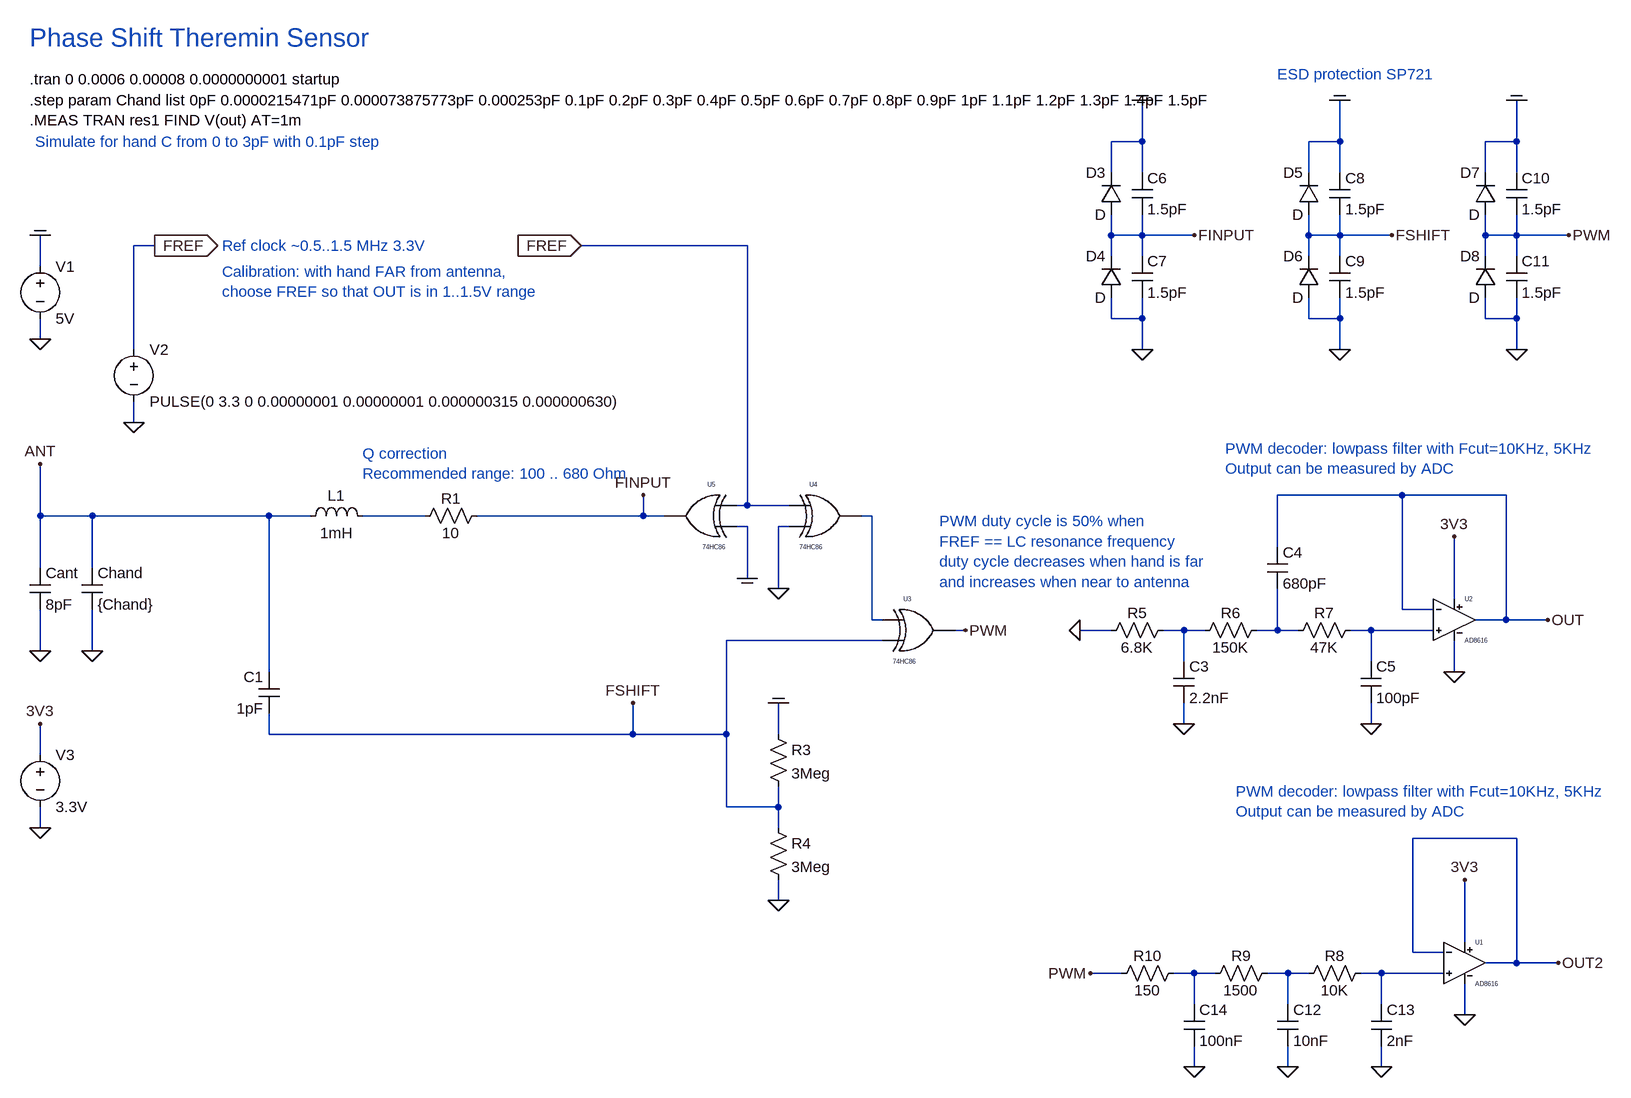
[diagram p0: schematic phase_shift_pwm_v6.asc]
phase_shift_pwm_v6.asc, the LTspice schematic file:
Version 4
SHEET 1 3724 1652
WIRE 1744 -208 1744 -272
WIRE 1744 -208 1696 -208
WIRE 2048 -208 2048 -272
WIRE 2048 -208 2000 -208
WIRE 2320 -208 2320 -272
WIRE 2320 -208 2272 -208
WIRE 1696 -160 1696 -208
WIRE 1744 -160 1744 -208
WIRE 2000 -160 2000 -208
WIRE 2048 -160 2048 -208
WIRE 2272 -160 2272 -208
WIRE 2320 -160 2320 -208
WIRE 1696 -64 1696 -96
WIRE 1744 -64 1744 -96
WIRE 1744 -64 1696 -64
WIRE 1824 -64 1744 -64
WIRE 2000 -64 2000 -96
WIRE 2048 -64 2048 -96
WIRE 2048 -64 2000 -64
WIRE 2128 -64 2048 -64
WIRE 2272 -64 2272 -96
WIRE 2320 -64 2320 -96
WIRE 2320 -64 2272 -64
WIRE 2400 -64 2320 -64
WIRE 224 -48 192 -48
WIRE 1136 -48 880 -48
WIRE 1696 -32 1696 -64
WIRE 1744 -32 1744 -64
WIRE 2000 -32 2000 -64
WIRE 2048 -32 2048 -64
WIRE 2272 -32 2272 -64
WIRE 2320 -32 2320 -64
WIRE 48 -16 48 -64
WIRE 1696 64 1696 32
WIRE 1744 64 1744 32
WIRE 1744 64 1696 64
WIRE 2000 64 2000 32
WIRE 2048 64 2048 32
WIRE 2048 64 2000 64
WIRE 2272 64 2272 32
WIRE 2320 64 2320 32
WIRE 2320 64 2272 64
WIRE 48 96 48 64
WIRE 192 112 192 -48
WIRE 1744 112 1744 64
WIRE 2048 112 2048 64
WIRE 2320 112 2320 64
WIRE 192 224 192 192
WIRE 2144 336 1952 336
WIRE 2304 336 2144 336
WIRE 1136 352 1136 -48
WIRE 1136 352 1120 352
WIRE 1200 352 1136 352
WIRE 48 368 48 288
WIRE 128 368 48 368
WIRE 400 368 128 368
WIRE 464 368 400 368
WIRE 640 368 544 368
WIRE 976 368 976 336
WIRE 976 368 720 368
WIRE 1008 368 976 368
WIRE 1328 368 1312 368
WIRE 1136 384 1120 384
WIRE 1200 384 1184 384
WIRE 1952 416 1952 336
WIRE 48 448 48 368
WIRE 128 448 128 368
WIRE 1136 464 1136 384
WIRE 1184 480 1184 384
WIRE 2224 496 2224 400
WIRE 2144 512 2144 336
WIRE 2192 512 2144 512
WIRE 1328 528 1328 368
WIRE 1344 528 1328 528
WIRE 2304 528 2304 336
WIRE 2304 528 2256 528
WIRE 2368 528 2304 528
WIRE 1472 544 1456 544
WIRE 1696 544 1648 544
WIRE 1808 544 1776 544
WIRE 1840 544 1808 544
WIRE 1952 544 1952 480
WIRE 1952 544 1920 544
WIRE 1984 544 1952 544
WIRE 2096 544 2064 544
WIRE 2192 544 2096 544
WIRE 1344 560 1104 560
WIRE 48 576 48 512
WIRE 128 576 128 512
WIRE 1808 592 1808 544
WIRE 2096 592 2096 544
WIRE 400 608 400 368
WIRE 2224 608 2224 560
WIRE 1808 688 1808 656
WIRE 2096 688 2096 656
WIRE 400 704 400 672
WIRE 960 704 960 656
WIRE 960 704 400 704
WIRE 1104 704 1104 560
WIRE 1104 704 960 704
WIRE 1184 704 1184 656
WIRE 48 736 48 688
WIRE 1104 816 1104 704
WIRE 1184 816 1184 784
WIRE 1184 816 1104 816
WIRE 48 848 48 816
WIRE 1184 848 1184 816
WIRE 2320 864 2160 864
WIRE 1184 960 1184 928
WIRE 2240 1024 2240 928
WIRE 2160 1040 2160 864
WIRE 2208 1040 2160 1040
WIRE 2320 1056 2320 864
WIRE 2320 1056 2272 1056
WIRE 2384 1056 2320 1056
WIRE 1712 1072 1664 1072
WIRE 1824 1072 1792 1072
WIRE 1856 1072 1824 1072
WIRE 1968 1072 1936 1072
WIRE 2000 1072 1968 1072
WIRE 2112 1072 2080 1072
WIRE 2208 1072 2112 1072
WIRE 1824 1120 1824 1072
WIRE 1968 1120 1968 1072
WIRE 2112 1120 2112 1072
WIRE 2240 1136 2240 1088
WIRE 1824 1216 1824 1184
WIRE 1968 1216 1968 1184
WIRE 2112 1216 2112 1184
FLAG 48 96 0
FLAG 224 -48 FREF
IOPIN 224 -48 Out
FLAG 192 224 0
FLAG 48 288 ANT
FLAG 48 576 0
FLAG 128 576 0
FLAG 1472 544 PWM
FLAG 880 -48 FREF
IOPIN 880 -48 In
FLAG 1184 960 0
FLAG 2224 608 0
FLAG 2368 528 OUT
FLAG 2096 688 0
FLAG 48 -64 COM
FLAG 1184 656 COM
FLAG 1744 112 0
FLAG 1744 -272 COM
FLAG 1824 -64 FINPUT
FLAG 2048 112 0
FLAG 2048 -272 COM
FLAG 2128 -64 FSHIFT
FLAG 2320 112 0
FLAG 2320 -272 COM
FLAG 2400 -64 PWM
FLAG 960 656 FSHIFT
FLAG 976 336 FINPUT
FLAG 1808 688 0
FLAG 1136 464 COM
FLAG 1184 480 0
FLAG 48 848 0
FLAG 48 688 3V3
FLAG 2224 400 3V3
FLAG 2240 1136 0
FLAG 2384 1056 OUT2
FLAG 2112 1216 0
FLAG 1824 1216 0
FLAG 1664 1072 PWM
FLAG 2240 928 3V3
FLAG 1968 1216 0
FLAG 1648 544 0
SYMBOL voltage 48 -32 R0
WINDOW 123 0 0 Left 2
WINDOW 39 0 0 Left 2
SYMATTR InstName V1
SYMATTR Value 5V
SYMBOL voltage 192 96 R0
WINDOW 123 0 0 Left 2
WINDOW 39 0 0 Left 2
SYMATTR InstName V2
SYMATTR Value PULSE(0 3.3 0 0.00000001 0.00000001 0.000000315 0.000000630)
SYMBOL ind 448 384 R270
WINDOW 0 32 56 VTop 2
WINDOW 3 5 56 VBottom 2
SYMATTR InstName L1
SYMATTR Value 1mH
SYMATTR SpiceLine Ipk=0.1 Rser=19.8 Rpar=6.283Meg Cpar=1.24pF
SYMBOL cap 32 448 R0
SYMATTR InstName Cant
SYMATTR Value 8pF
SYMBOL cap 112 448 R0
SYMATTR InstName Chand
SYMATTR Value {Chand}
SYMBOL EXTRA\\74HC\\74hc86 1392 480 R0
SYMATTR InstName U3
SYMBOL res 736 352 R90
WINDOW 0 5 56 VBottom 2
WINDOW 3 27 56 VTop 2
SYMATTR InstName R1
SYMATTR Value 10
SYMBOL cap 416 672 R180
WINDOW 0 24 56 Left 2
WINDOW 3 24 8 Left 2
SYMATTR InstName C1
SYMATTR Value 1pF
SYMBOL res 1168 688 R0
SYMATTR InstName R3
SYMATTR Value 3Meg
SYMBOL res 1168 832 R0
SYMATTR InstName R4
SYMATTR Value 3Meg
SYMBOL res 2080 528 R90
WINDOW 0 5 56 VBottom 2
WINDOW 3 27 56 VTop 2
SYMATTR InstName R7
SYMATTR Value 47K
SYMBOL cap 1936 416 R0
SYMATTR InstName C4
SYMATTR Value 680pF
SYMBOL cap 2080 592 R0
SYMATTR InstName C5
SYMATTR Value 100pF
SYMBOL EXTRA\\AudioOpamp\\AD\\AD8616 2224 528 R0
SYMATTR InstName U2
SYMBOL res 1936 528 R90
WINDOW 0 5 56 VBottom 2
WINDOW 3 27 56 VTop 2
SYMATTR InstName R6
SYMATTR Value 150K
SYMBOL diode 1712 -96 R180
WINDOW 0 24 64 Left 2
WINDOW 3 24 0 Left 2
SYMATTR InstName D3
SYMBOL diode 1712 32 R180
WINDOW 0 24 64 Left 2
WINDOW 3 24 0 Left 2
SYMATTR InstName D4
SYMBOL cap 1728 -160 R0
SYMATTR InstName C6
SYMATTR Value 1.5pF
SYMBOL cap 1728 -32 R0
SYMATTR InstName C7
SYMATTR Value 1.5pF
SYMBOL diode 2016 -96 R180
WINDOW 0 24 64 Left 2
WINDOW 3 24 0 Left 2
SYMATTR InstName D5
SYMBOL diode 2016 32 R180
WINDOW 0 24 64 Left 2
WINDOW 3 24 0 Left 2
SYMATTR InstName D6
SYMBOL cap 2032 -160 R0
SYMATTR InstName C8
SYMATTR Value 1.5pF
SYMBOL cap 2032 -32 R0
SYMATTR InstName C9
SYMATTR Value 1.5pF
SYMBOL diode 2288 -96 R180
WINDOW 0 24 64 Left 2
WINDOW 3 24 0 Left 2
SYMATTR InstName D7
SYMBOL diode 2288 32 R180
WINDOW 0 24 64 Left 2
WINDOW 3 24 0 Left 2
SYMATTR InstName D8
SYMBOL cap 2304 -160 R0
SYMATTR InstName C10
SYMATTR Value 1.5pF
SYMBOL cap 2304 -32 R0
SYMATTR InstName C11
SYMATTR Value 1.5pF
SYMBOL cap 1792 592 R0
SYMATTR InstName C3
SYMATTR Value 2.2nF
SYMBOL res 1792 528 R90
WINDOW 0 5 56 VBottom 2
WINDOW 3 27 56 VTop 2
SYMATTR InstName R5
SYMATTR Value 6.8K
SYMBOL EXTRA\\74HC\\74hc86 1248 304 R0
SYMATTR InstName U4
SYMBOL EXTRA\\74HC\\74hc86 1072 304 M0
SYMATTR InstName U5
SYMBOL voltage 48 720 R0
WINDOW 123 0 0 Left 2
WINDOW 39 0 0 Left 2
SYMATTR InstName V3
SYMATTR Value 3.3V
SYMBOL res 2096 1056 R90
WINDOW 0 5 56 VBottom 2
WINDOW 3 27 56 VTop 2
SYMATTR InstName R8
SYMATTR Value 10K
SYMBOL cap 1952 1120 R0
SYMATTR InstName C12
SYMATTR Value 10nF
SYMBOL cap 2096 1120 R0
SYMATTR InstName C13
SYMATTR Value 2nF
SYMBOL EXTRA\\AudioOpamp\\AD\\AD8616 2240 1056 R0
SYMATTR InstName U1
SYMBOL res 1952 1056 R90
WINDOW 0 5 56 VBottom 2
WINDOW 3 27 56 VTop 2
SYMATTR InstName R9
SYMATTR Value 1500
SYMBOL cap 1808 1120 R0
SYMATTR InstName C14
SYMATTR Value 100nF
SYMBOL res 1808 1056 R90
WINDOW 0 5 56 VBottom 2
WINDOW 3 27 56 VTop 2
SYMATTR InstName R10
SYMATTR Value 150
TEXT 32 -304 Left 2 !.tran 0 0.0006 0.00008 0.0000000001 startup
TEXT 32 -272 Left 2 !.step param Chand list 0pF 0.0000215471pF 0.000073875773pF 0.000253pF 0.1pF 0.2pF 0.3pF 0.4pF 0.5pF 0.6pF 0.7pF 0.8pF 0.9pF 1pF 1.1pF 1.2pF 1.3pF 1.4pF 1.5pF\n.MEAS TRAN res1 FIND V(out) AT=1m
TEXT 328 -48 Left 2 ;Ref clock ~0.5..1.5 MHz 3.3V
TEXT 32 -368 Left 4 ;Phase Shift Theremin Sensor
TEXT 1872 264 Left 2 ;PWM decoder: lowpass filter with Fcut=10KHz, 5KHz\nOutput can be measured by ADC
TEXT 544 272 Left 2 ;Q correction\nRecommended range: 100 .. 680 Ohm
TEXT 1952 -312 Left 2 ;ESD protection SP721
TEXT 328 -8 Left 2 ;Calibration: with hand FAR from antenna,\nchoose FREF so that OUT is in 1..1.5V range
TEXT 1432 376 Left 2 ;PWM duty cycle is 50% when \nFREF == LC resonance frequency\nduty cycle decreases when hand is far \nand increases when near to antenna
TEXT 40 -208 Left 2 ;Simulate for hand C from 0 to 3pF with 0.1pF step
TEXT 1888 792 Left 2 ;PWM decoder: lowpass filter with Fcut=10KHz, 5KHz\nOutput can be measured by ADC

The netlist it stands for:
* phase_shift_pwm_v6.asc
V1 COM 0 5V
V2 FREF 0 PULSE(0 3.3 0 0.00000001 0.00000001 0.000000315 0.000000630)
L1 ANT N001 1mH Ipk=0.1 Rser=19.8 Rpar=6.283Meg Cpar=1.24pF
Cant ANT 0 8pF
Chand ANT 0 {Chand}
XU3 N002 FSHIFT PWM VCC 0 74HC86 VCC=5  SPEED=1.0  TRIPDT=1e-9  ; pins A B Y
R1 FINPUT N001 10
C1 FSHIFT ANT 1pF
R3 COM FSHIFT 3Meg
R4 FSHIFT 0 3Meg
R7 N005 N004 47K
C4 OUT N004 680pF
C5 N005 0 100pF
XU2 N005 OUT 3V3 0 OUT AD8616  ; pins In+ In- V+ V- OUT
R6 N004 N003 150K
D3 FINPUT COM D
D4 0 FINPUT D
C6 COM FINPUT 1.5pF
C7 FINPUT 0 1.5pF
D5 FSHIFT COM D
D6 0 FSHIFT D
C8 COM FSHIFT 1.5pF
C9 FSHIFT 0 1.5pF
D7 PWM COM D
D8 0 PWM D
C10 COM PWM 1.5pF
C11 PWM 0 1.5pF
C3 N003 0 2.2nF
R5 N003 0 6.8K
XU4 FREF 0 N002 VCC 0 74HC86 VCC=5  SPEED=1.0  TRIPDT=1e-9  ; pins A B Y
XU5 FREF COM FINPUT VCC 0 74HC86 VCC=5  SPEED=1.0  TRIPDT=1e-9  ; pins A B Y
V3 3V3 0 3.3V
R8 N008 N007 10K
C12 N007 0 10nF
C13 N008 0 2nF
XU1 N008 OUT2 3V3 0 OUT2 AD8616  ; pins In+ In- V+ V- OUT
R9 N007 N006 1500
C14 N006 0 100nF
R10 N006 PWM 150
.model D D
.lib standard.dio
.tran 0 0.0006 0.00008 0.0000000001 startup
.step param Chand list 0pF 0.0000215471pF 0.000073875773pF 0.000253pF 0.1pF 0.2pF 0.3pF 0.4pF 0.5pF 0.6pF 0.7pF 0.8pF 0.9pF 1pF 1.1pF 1.2pF 1.3pF 1.4pF 1.5pF
.MEAS TRAN res1 FIND V(out) AT=1m
* Ref clock ~0.5..1.5 MHz 3.3V
* Phase Shift Theremin Sensor
* PWM decoder: lowpass filter with Fcut=10KHz, 5KHz
* Output can be measured by ADC
* Q correction
* Recommended range: 100 .. 680 Ohm
* ESD protection SP721
* Calibration: with hand FAR from antenna,
* choose FREF so that OUT is in 1..1.5V range
* PWM duty cycle is 50% when
* FREF == LC resonance frequency
* duty cycle decreases when hand is far
* and increases when near to antenna
* Simulate for hand C from 0 to 3pF with 0.1pF step
* PWM decoder: lowpass filter with Fcut=10KHz, 5KHz
* Output can be measured by ADC
.lib 74HC.lib
.lib AD8616.cir
.backanno
.end